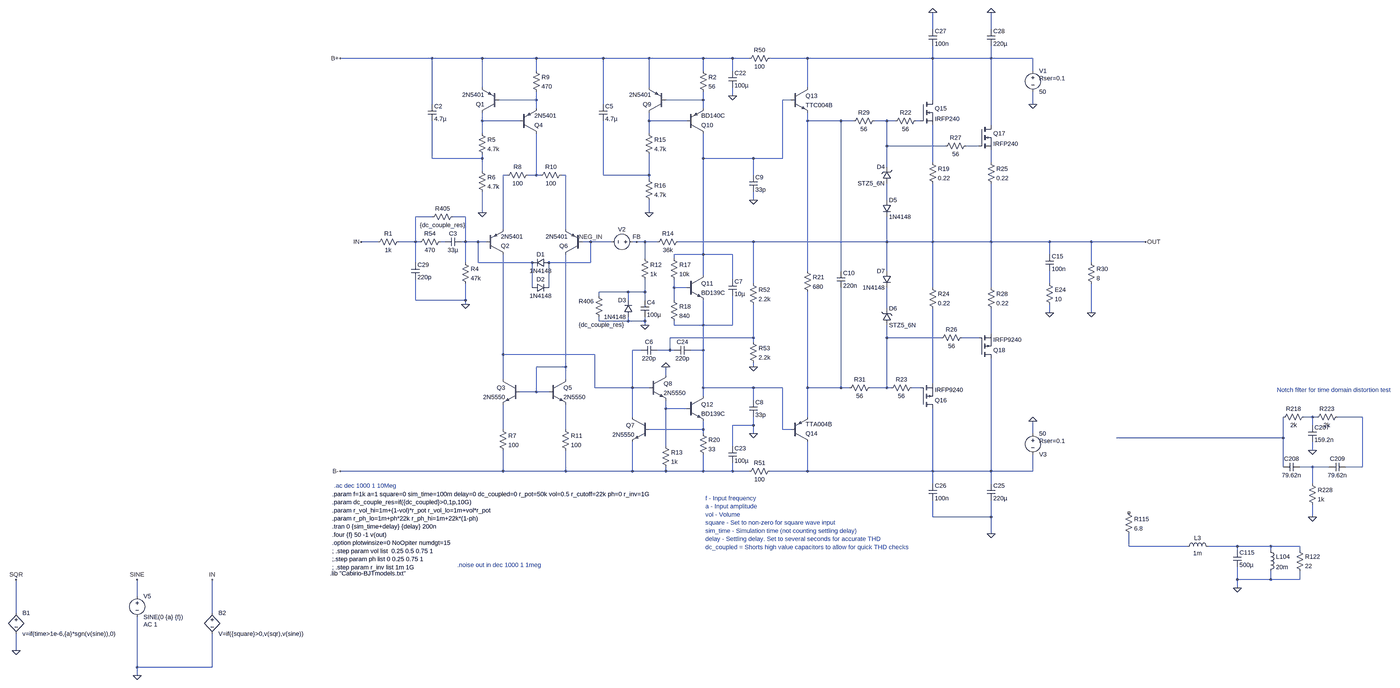
[diagram p0: schematic bog-standard-200w.asc, whole sheet]
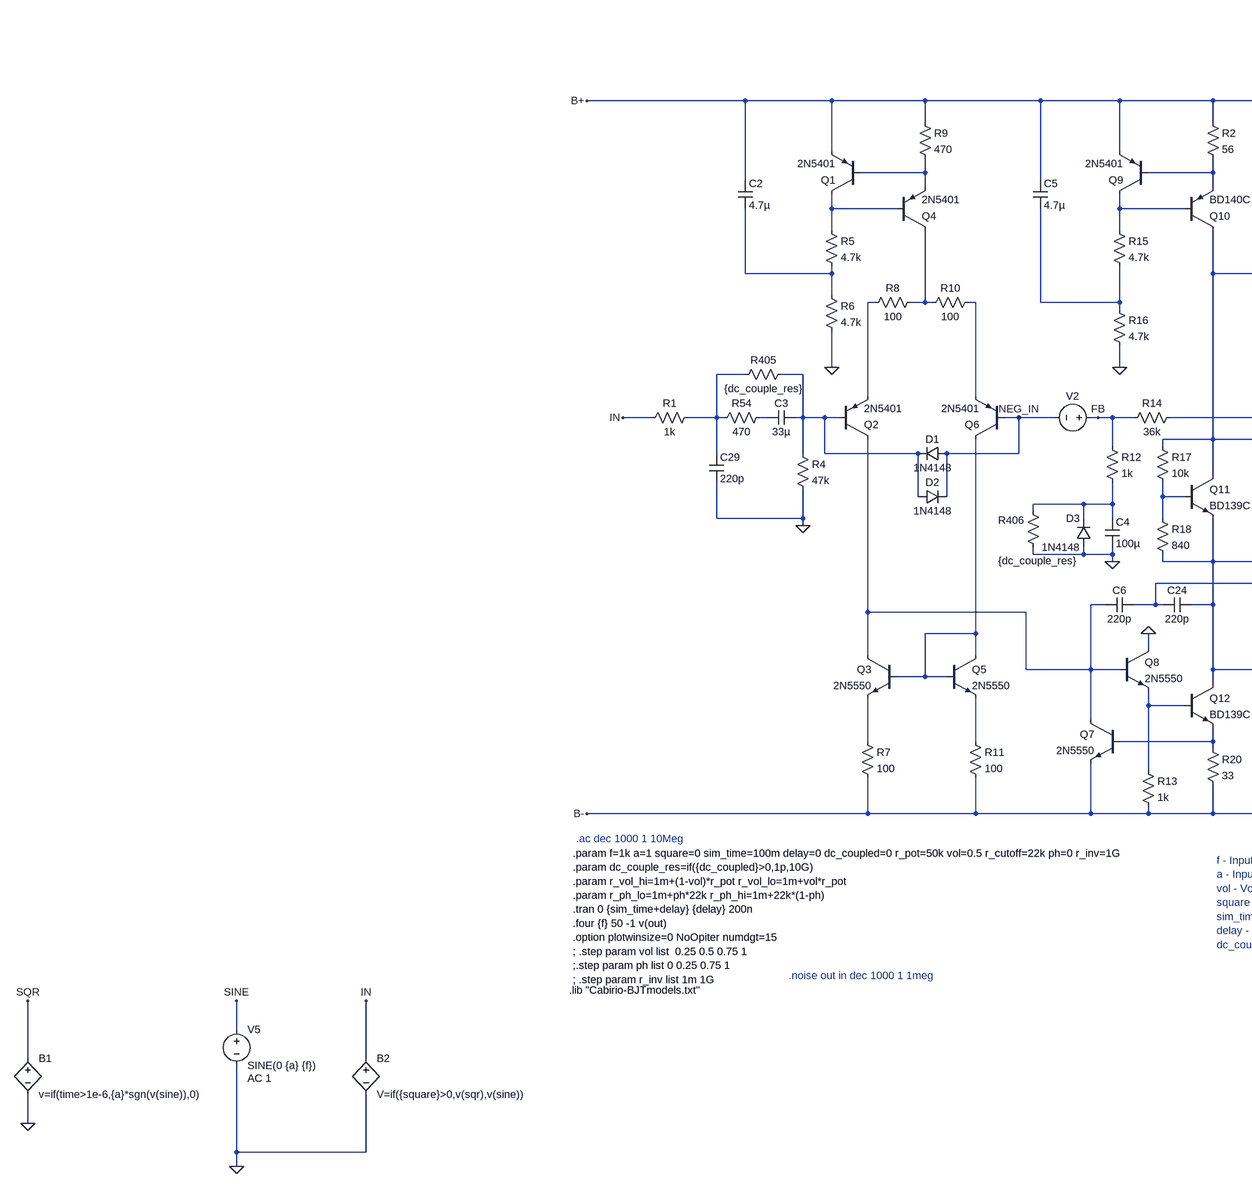
[diagram p1: schematic bog-standard-200w.asc, part, row 1 of 1, column 1 of 2]
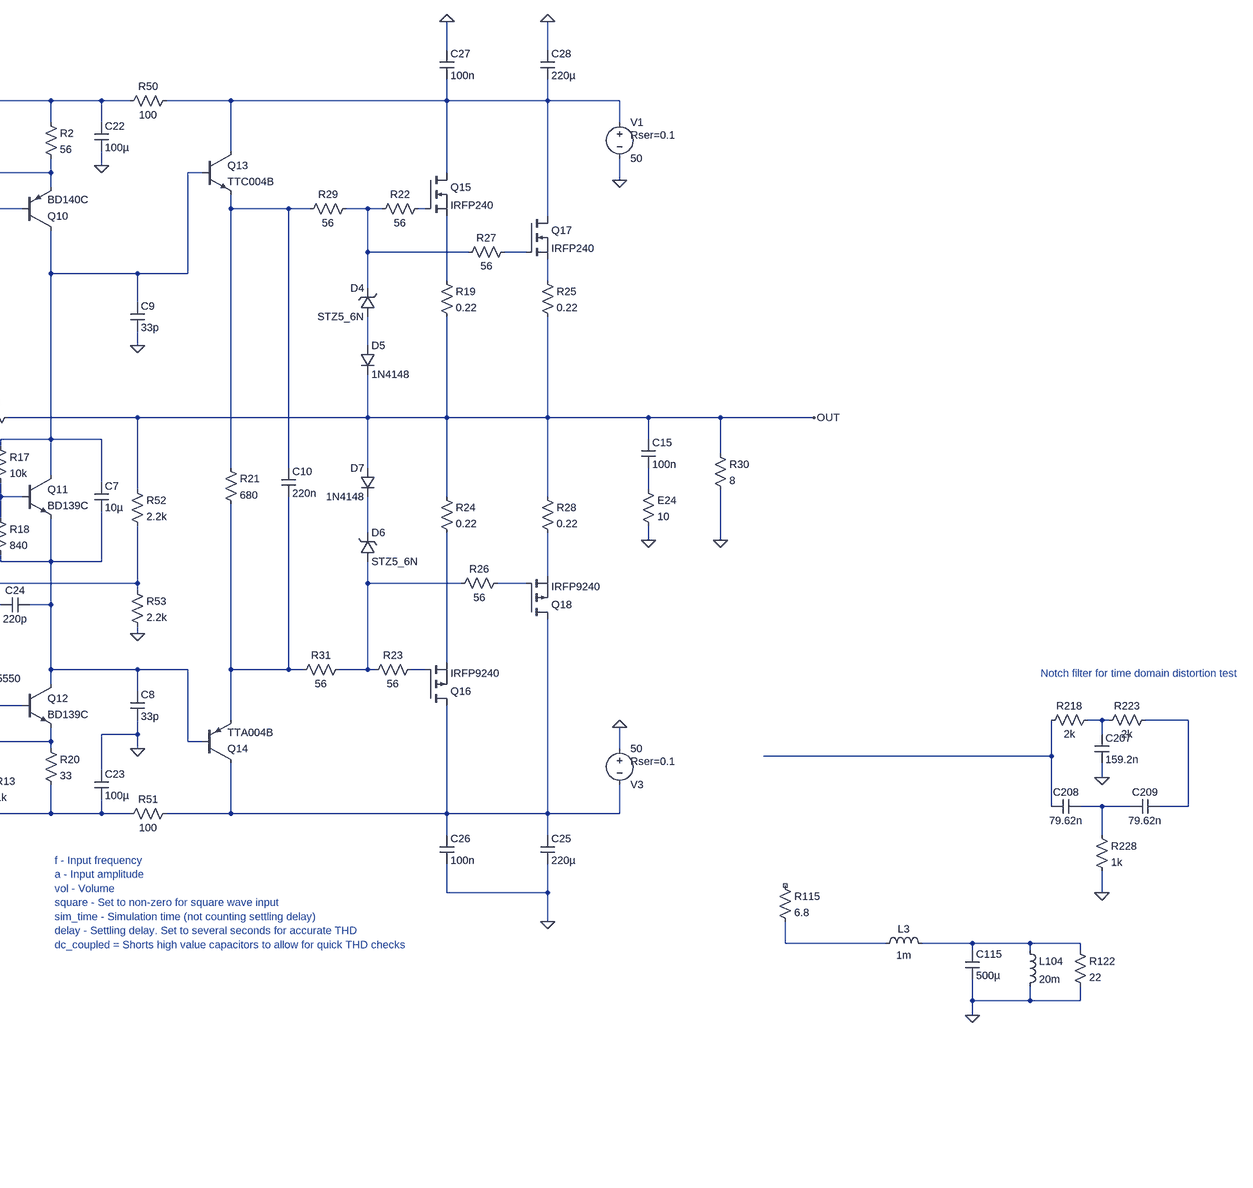
[diagram p2: schematic bog-standard-200w.asc, part, row 1 of 1, column 2 of 2]
bog-standard-200w.asc, the LTspice schematic file:
Version 4
SHEET 1 3812 1508
WIRE 1632 -992 1632 -1056
WIRE 1856 -992 1856 -1056
WIRE -288 -880 -640 -880
WIRE -96 -880 -288 -880
WIRE 112 -880 -96 -880
WIRE 368 -880 112 -880
WIRE 544 -880 368 -880
WIRE 752 -880 544 -880
WIRE 864 -880 752 -880
WIRE 928 -880 864 -880
WIRE 1152 -880 1008 -880
WIRE 1632 -880 1632 -928
WIRE 1632 -880 1152 -880
WIRE 1856 -880 1856 -928
WIRE 1856 -880 1632 -880
WIRE 2016 -880 1856 -880
WIRE 112 -832 112 -880
WIRE 752 -832 752 -880
WIRE 864 -832 864 -880
WIRE 2016 -832 2016 -880
WIRE -96 -768 -96 -880
WIRE 544 -768 544 -880
WIRE 1152 -768 1152 -880
WIRE 864 -736 864 -768
WIRE 112 -720 112 -752
WIRE 112 -720 -32 -720
WIRE 752 -720 752 -752
WIRE 752 -720 608 -720
WIRE 1088 -720 1056 -720
WIRE 1632 -720 1632 -880
WIRE -288 -704 -288 -880
WIRE 368 -704 368 -880
WIRE 2016 -704 2016 -752
WIRE 112 -688 112 -720
WIRE 752 -688 752 -720
WIRE -96 -640 -96 -672
WIRE 48 -640 -96 -640
WIRE 544 -640 544 -672
WIRE 688 -640 544 -640
WIRE 1152 -640 1152 -672
WIRE 1280 -640 1152 -640
WIRE 1328 -640 1280 -640
WIRE 1456 -640 1408 -640
WIRE 1488 -640 1456 -640
WIRE 1584 -640 1568 -640
WIRE 1856 -624 1856 -880
WIRE -96 -592 -96 -640
WIRE 544 -592 544 -640
WIRE 1456 -544 1456 -640
WIRE 1680 -544 1456 -544
WIRE 1808 -544 1760 -544
WIRE -288 -496 -288 -640
WIRE -96 -496 -96 -512
WIRE -96 -496 -288 -496
WIRE 752 -496 752 -592
WIRE 944 -496 752 -496
WIRE 1056 -496 1056 -720
WIRE 1056 -496 944 -496
WIRE 1632 -480 1632 -624
WIRE 1856 -480 1856 -528
WIRE 1456 -464 1456 -544
WIRE -96 -448 -96 -496
WIRE 0 -432 -16 -432
WIRE 112 -432 112 -592
WIRE 112 -432 80 -432
WIRE 128 -432 112 -432
WIRE 224 -432 208 -432
WIRE 368 -432 368 -640
WIRE 544 -432 544 -512
WIRE 544 -432 368 -432
WIRE 944 -432 944 -496
WIRE 544 -416 544 -432
WIRE 944 -336 944 -368
WIRE 1456 -336 1456 -400
WIRE -96 -288 -96 -368
WIRE 544 -288 544 -336
WIRE -288 -272 -352 -272
WIRE -160 -272 -208 -272
WIRE -16 -224 -16 -432
WIRE 224 -224 224 -432
WIRE -496 -176 -560 -176
WIRE -352 -176 -352 -272
WIRE -352 -176 -416 -176
WIRE -336 -176 -352 -176
WIRE -240 -176 -256 -176
WIRE -160 -176 -160 -272
WIRE -160 -176 -176 -176
WIRE -112 -176 -160 -176
WIRE -80 -176 -112 -176
WIRE 320 -176 288 -176
WIRE 400 -176 320 -176
WIRE 496 -176 480 -176
WIRE 528 -176 496 -176
WIRE 576 -176 528 -176
WIRE 944 -176 656 -176
WIRE 1456 -176 1456 -272
WIRE 1456 -176 944 -176
WIRE 1632 -176 1632 -400
WIRE 1632 -176 1456 -176
WIRE 1856 -176 1856 -400
WIRE 1856 -176 1632 -176
WIRE 2080 -176 1856 -176
WIRE 2240 -176 2080 -176
WIRE 2448 -176 2240 -176
WIRE 752 -128 752 -496
WIRE 752 -128 640 -128
WIRE 864 -128 752 -128
WIRE 2080 -128 2080 -176
WIRE 528 -112 528 -176
WIRE 640 -112 640 -128
WIRE -352 -96 -352 -176
WIRE -160 -96 -160 -176
WIRE -112 -96 -112 -176
WIRE 96 -96 -112 -96
WIRE 160 -96 144 -96
WIRE 320 -96 320 -176
WIRE 320 -96 160 -96
WIRE 2240 -96 2240 -176
WIRE 1152 -64 1152 -640
WIRE 1280 -64 1280 -640
WIRE 1456 -64 1456 -176
WIRE 752 -48 752 -128
WIRE 864 -32 864 -128
WIRE 944 -16 944 -176
WIRE 2080 -16 2080 -64
WIRE 96 0 96 -96
WIRE 160 0 160 -96
WIRE 640 0 640 -32
WIRE 688 0 640 0
WIRE 1632 0 1632 -176
WIRE 1856 0 1856 -176
WIRE 464 16 352 16
WIRE 528 16 528 -32
WIRE 528 16 464 16
WIRE 352 32 352 16
WIRE -352 48 -352 -32
WIRE -160 48 -160 -16
WIRE -160 48 -352 48
WIRE 464 48 464 16
WIRE 528 48 528 16
WIRE 640 48 640 0
WIRE -160 64 -160 48
WIRE 1456 80 1456 0
WIRE 2080 96 2080 64
WIRE 2240 96 2240 -16
WIRE 352 128 352 112
WIRE 464 128 464 112
WIRE 464 128 352 128
WIRE 528 128 528 112
WIRE 528 128 464 128
WIRE 528 144 528 128
WIRE 640 144 640 128
WIRE 752 144 752 48
WIRE 752 144 640 144
WIRE 864 144 864 32
WIRE 864 144 752 144
WIRE 1856 176 1856 80
WIRE 944 192 944 64
WIRE 944 192 624 192
WIRE 1456 192 1456 144
WIRE 1664 192 1456 192
WIRE 1808 192 1744 192
WIRE 944 208 944 192
WIRE 512 240 480 240
WIRE 624 240 624 192
WIRE 624 240 576 240
WIRE 640 240 624 240
WIRE 752 240 752 144
WIRE 752 240 704 240
WIRE -16 256 -16 -128
WIRE 336 256 -16 256
WIRE 224 304 224 -128
WIRE 224 304 112 304
WIRE 944 304 944 288
WIRE 608 336 608 304
WIRE -16 352 -16 256
WIRE 224 352 224 304
WIRE 1632 368 1632 80
WIRE 336 384 336 256
WIRE 480 384 480 240
WIRE 480 384 336 384
WIRE 544 384 480 384
WIRE 752 384 752 240
WIRE 944 384 752 384
WIRE 1056 384 944 384
WIRE 1152 384 1152 16
WIRE 1280 384 1280 0
WIRE 1280 384 1152 384
WIRE 1312 384 1280 384
WIRE 1456 384 1456 192
WIRE 1456 384 1392 384
WIRE 1472 384 1456 384
WIRE 1584 384 1552 384
WIRE 112 400 112 304
WIRE 112 400 48 400
WIRE 160 400 112 400
WIRE 752 416 752 384
WIRE 944 432 944 384
WIRE 608 464 608 432
WIRE 688 464 608 464
WIRE 480 496 480 384
WIRE 1152 496 1152 384
WIRE 3088 496 3056 496
WIRE 3104 496 3088 496
WIRE 3280 496 3184 496
WIRE 944 528 944 496
WIRE 944 528 864 528
WIRE 3088 528 3088 496
WIRE -16 544 -16 448
WIRE 224 544 224 448
WIRE 752 544 752 512
WIRE 752 544 544 544
WIRE 1056 544 1056 384
WIRE 1088 544 1056 544
WIRE 752 560 752 544
WIRE 944 560 944 528
WIRE 2016 560 2016 512
WIRE 2976 576 2976 496
WIRE 2976 576 2336 576
WIRE 608 608 608 464
WIRE 864 608 864 528
WIRE 3088 624 3088 592
WIRE 2976 688 2976 576
WIRE 3088 688 3040 688
WIRE 3152 688 3088 688
WIRE 3280 688 3280 496
WIRE 3280 688 3216 688
WIRE -16 704 -16 624
WIRE -16 704 -640 704
WIRE 224 704 224 624
WIRE 224 704 -16 704
WIRE 480 704 480 592
WIRE 480 704 224 704
WIRE 608 704 608 688
WIRE 608 704 480 704
WIRE 752 704 752 640
WIRE 752 704 608 704
WIRE 864 704 864 672
WIRE 864 704 752 704
WIRE 928 704 864 704
WIRE 1152 704 1152 592
WIRE 1152 704 1008 704
WIRE 1632 704 1632 464
WIRE 1632 704 1152 704
WIRE 1856 704 1856 272
WIRE 1856 704 1632 704
WIRE 2016 704 2016 640
WIRE 2016 704 1856 704
WIRE 1632 752 1632 704
WIRE 1856 752 1856 704
WIRE 3088 752 3088 688
WIRE 1632 880 1632 816
WIRE 1856 880 1856 816
WIRE 1856 880 1632 880
WIRE 3088 880 3088 832
WIRE 1856 944 1856 880
WIRE 2384 992 2384 944
WIRE 2608 992 2384 992
WIRE 2800 992 2688 992
WIRE 2928 992 2800 992
WIRE 3040 992 2928 992
WIRE 2800 1008 2800 992
WIRE 2928 1008 2928 992
WIRE 3040 1008 3040 992
WIRE 2800 1120 2800 1072
WIRE 2928 1120 2928 1088
WIRE 2928 1120 2800 1120
WIRE 3040 1120 3040 1088
WIRE 3040 1120 2928 1120
WIRE 2800 1152 2800 1120
WIRE -1456 1184 -1456 1120
WIRE -1920 1248 -1920 1120
WIRE -1168 1248 -1168 1120
WIRE -1920 1392 -1920 1328
WIRE -1456 1456 -1456 1264
WIRE -1168 1456 -1168 1328
WIRE -1168 1456 -1456 1456
WIRE -1456 1488 -1456 1456
FLAG 528 144 0
FLAG -560 -176 IN
FLAG -1168 1120 IN
FLAG -640 704 B-
FLAG -640 -880 B+
FLAG 2448 -176 OUT
FLAG 320 -176 NEG_IN
FLAG 496 -176 FB
FLAG 2080 96 0
FLAG 3088 624 0
FLAG 3088 880 0
FLAG -1456 1488 0
FLAG 944 560 0
FLAG 944 -336 0
FLAG -1920 1392 0
FLAG -1456 1120 SINE
FLAG -1920 1120 SQR
FLAG 608 304 0
FLAG -160 64 0
FLAG 2800 1152 0
FLAG -96 -288 0
FLAG 544 -288 0
FLAG 2240 96 0
FLAG 2016 -704 0
FLAG 2016 512 0
FLAG 864 -736 0
FLAG 944 304 0
FLAG 1856 944 0
FLAG 1632 -1056 0
FLAG 1856 -1056 0
SYMBOL res 672 -192 R90
WINDOW 0 0 56 VBottom 2
WINDOW 3 32 56 VTop 2
SYMATTR InstName R14
SYMATTR Value 36k
SYMBOL res 512 -128 R0
SYMATTR InstName R12
SYMATTR Value 1k
SYMBOL cap 512 48 R0
SYMATTR InstName C4
SYMATTR Value 100µ
SYMBOL res -176 -112 R0
SYMATTR InstName R4
SYMATTR Value 47k
SYMBOL res -400 -192 R90
WINDOW 0 0 56 VBottom 2
WINDOW 3 32 56 VTop 2
SYMATTR InstName R1
SYMATTR Value 1k
SYMBOL cap 576 224 R90
WINDOW 0 0 32 VBottom 2
WINDOW 3 32 32 VTop 2
SYMATTR InstName C6
SYMATTR Value 220p
SYMBOL npn 688 -48 R0
SYMATTR InstName Q11
SYMATTR Value BD139C
SYMBOL res 624 -128 R0
SYMATTR InstName R17
SYMATTR Value 10k
SYMBOL res 624 32 R0
SYMATTR InstName R18
SYMATTR Value 840
SYMBOL cap 2064 -128 R0
SYMATTR InstName C15
SYMATTR Value 100n
SYMBOL res 2064 -32 R0
SYMATTR InstName E24
SYMATTR Value 10
SYMBOL cap 848 -32 R0
SYMATTR InstName C7
SYMATTR Value 10µ
SYMBOL voltage -1456 1168 R0
WINDOW 123 24 124 Left 2
WINDOW 39 0 0 Left 0
SYMATTR Value2 AC 1
SYMATTR InstName V5
SYMATTR Value SINE(0 {a} {f})
SYMBOL res 3072 480 R90
WINDOW 0 0 56 VBottom 2
WINDOW 3 32 56 VTop 2
SYMATTR InstName R218
SYMATTR Value 2k
SYMBOL res 3200 480 R90
WINDOW 0 0 56 VBottom 2
WINDOW 3 32 56 VTop 2
SYMATTR InstName R223
SYMATTR Value 2k
SYMBOL cap 3072 528 R0
SYMATTR InstName C207
SYMATTR Value 159.2n
SYMBOL cap 2976 704 R270
WINDOW 0 32 32 VTop 2
WINDOW 3 0 32 VBottom 2
SYMATTR InstName C208
SYMATTR Value 79.62n
SYMBOL cap 3152 704 R270
WINDOW 0 32 32 VTop 2
WINDOW 3 0 32 VBottom 2
SYMATTR InstName C209
SYMATTR Value 79.62n
SYMBOL res 3072 736 R0
SYMATTR InstName R228
SYMATTR Value 1k
SYMBOL nmos 1584 -720 R0
SYMATTR InstName Q15
SYMATTR Value IRFP240
SYMBOL pmos 1584 464 M180
SYMATTR InstName Q16
SYMATTR Value IRFP9240
SYMBOL res 1584 -656 R90
WINDOW 0 0 56 VBottom 2
WINDOW 3 32 56 VTop 2
SYMATTR InstName R22
SYMATTR Value 56
SYMBOL res 1568 368 R90
WINDOW 0 0 56 VBottom 2
WINDOW 3 32 56 VTop 2
SYMATTR InstName R23
SYMATTR Value 56
SYMBOL diode 1440 -336 R0
SYMATTR InstName D5
SYMATTR Value 1N4148
SYMBOL zener 1472 -400 R180
WINDOW 0 24 64 Left 2
WINDOW 3 24 0 Left 2
SYMATTR InstName D4
SYMATTR Value STZ5_6N
SYMATTR Description Diode
SYMATTR Type diode
SYMBOL zener 1440 144 M180
WINDOW 0 24 64 Left 2
WINDOW 3 24 0 Left 2
SYMATTR InstName D6
SYMATTR Value STZ5_6N
SYMATTR Description Diode
SYMATTR Type diode
SYMBOL diode 1472 -64 M0
SYMATTR InstName D7
SYMATTR Value 1N4148
SYMBOL cap -176 -192 R90
WINDOW 0 0 32 VBottom 2
WINDOW 3 32 32 VTop 2
SYMATTR InstName C3
SYMATTR Value 33µ
SYMBOL npn 1088 -768 R0
SYMATTR InstName Q13
SYMATTR Value TTC004B
SYMBOL pnp 1088 592 M180
SYMATTR InstName Q14
SYMATTR Value TTA004B
SYMBOL res 1136 -80 R0
SYMATTR InstName R21
SYMATTR Value 680
SYMBOL cap 1264 -64 R0
SYMATTR InstName C10
SYMATTR Value 220n
SYMBOL bv -1920 1232 R0
SYMATTR InstName B1
SYMATTR Value v=if(time>1e-6,{a}*sgn(v(sine)),0)
SYMBOL bv -1168 1232 R0
SYMATTR InstName B2
SYMATTR Value V=if({square}>0,v(sqr),v(sine))
SYMBOL npn 688 416 R0
SYMATTR InstName Q12
SYMATTR Value BD139C
SYMBOL npn 544 336 R0
SYMATTR InstName Q8
SYMATTR Value 2N5550
SYMBOL res 736 544 R0
SYMATTR InstName R20
SYMATTR Value 33
SYMBOL diode 480 112 R180
WINDOW 0 24 64 Left 2
WINDOW 3 24 0 Left 2
SYMATTR InstName D3
SYMATTR Value 1N4148
SYMBOL pnp 688 -592 M180
SYMATTR InstName Q10
SYMATTR Value BD140C
SYMBOL pnp 608 -672 R180
SYMATTR InstName Q9
SYMATTR Value 2N5401
SYMBOL res 528 -608 R0
SYMATTR InstName R15
SYMATTR Value 4.7k
SYMBOL npn 160 352 R0
SYMATTR InstName Q5
SYMATTR Value 2N5550
SYMBOL npn 48 352 M0
SYMATTR InstName Q3
SYMATTR Value 2N5550
SYMBOL res -32 528 R0
SYMATTR InstName R7
SYMATTR Value 100
SYMBOL res 208 528 R0
SYMATTR InstName R11
SYMATTR Value 100
SYMBOL pnp 48 -592 M180
SYMATTR InstName Q4
SYMATTR Value 2N5401
SYMBOL res 96 -848 R0
SYMATTR InstName R9
SYMATTR Value 470
SYMBOL pnp -32 -672 R180
SYMATTR InstName Q1
SYMATTR Value 2N5401
SYMBOL res -112 -608 R0
SYMATTR InstName R5
SYMATTR Value 4.7k
SYMBOL res 224 -448 R90
WINDOW 0 0 56 VBottom 2
WINDOW 3 32 56 VTop 2
SYMATTR InstName R10
SYMATTR Value 100
SYMBOL res 96 -448 R90
WINDOW 0 0 56 VBottom 2
WINDOW 3 32 56 VTop 2
SYMATTR InstName R8
SYMATTR Value 100
SYMBOL pnp 288 -128 R180
SYMATTR InstName Q6
SYMATTR Value 2N5401
SYMBOL pnp -80 -128 M180
SYMATTR InstName Q2
SYMATTR Value 2N5401
SYMBOL res -192 -288 R90
WINDOW 0 0 56 VBottom 2
WINDOW 3 32 56 VTop 2
SYMATTR InstName R405
SYMATTR Value {dc_couple_res}
SYMBOL res 368 128 R180
WINDOW 0 36 76 Left 2
WINDOW 3 -80 -14 Left 2
SYMATTR InstName R406
SYMATTR Value {dc_couple_res}
SYMBOL res 2368 848 R0
SYMATTR InstName R115
SYMATTR Value 6.8
SYMBOL ind 2592 1008 R270
WINDOW 0 32 56 VTop 2
WINDOW 3 5 56 VBottom 2
SYMATTR InstName L3
SYMATTR Value 1m
SYMBOL cap 2784 1008 R0
SYMATTR InstName C115
SYMATTR Value 500µ
SYMBOL ind 2912 992 R0
SYMATTR InstName L104
SYMATTR Value 20m
SYMBOL res 3024 992 R0
SYMATTR InstName R122
SYMATTR Value 22
SYMBOL voltage 496 -176 R90
WINDOW 0 -32 56 VBottom 2
WINDOW 3 32 56 VTop 2
WINDOW 123 -4 56 VBottom 2
WINDOW 39 0 0 Left 0
SYMATTR InstName V2
SYMATTR Value ""
SYMBOL npn 544 496 M0
SYMATTR InstName Q7
SYMATTR Value 2N5550
SYMBOL res -112 -464 R0
SYMATTR InstName R6
SYMATTR Value 4.7k
SYMBOL res 528 -432 R0
SYMATTR InstName R16
SYMATTR Value 4.7k
SYMBOL res 2224 -112 R0
SYMATTR InstName R30
SYMATTR Value 8
SYMBOL cap -304 -704 R0
SYMATTR InstName C2
SYMATTR Value 4.7µ
SYMBOL cap 352 -704 R0
SYMATTR InstName C5
SYMATTR Value 4.7µ
SYMBOL diode 160 -112 R90
WINDOW 0 0 32 VBottom 2
WINDOW 3 32 32 VTop 2
SYMATTR InstName D1
SYMATTR Value 1N4148
SYMBOL diode 96 16 R270
WINDOW 0 32 32 VTop 2
WINDOW 3 0 32 VBottom 2
SYMATTR InstName D2
SYMATTR Value 1N4148
SYMBOL res 736 -848 R0
SYMATTR InstName R2
SYMATTR Value 56
SYMBOL res 592 592 R0
SYMATTR InstName R13
SYMATTR Value 1k
SYMBOL res 1616 -496 R0
SYMATTR InstName R19
SYMATTR Value 0.22
SYMBOL res 1616 -16 R0
SYMATTR InstName R24
SYMATTR Value 0.22
SYMBOL nmos 1808 -624 R0
SYMATTR InstName Q17
SYMATTR Value IRFP240
SYMBOL res 1776 -560 R90
WINDOW 0 0 56 VBottom 2
WINDOW 3 32 56 VTop 2
SYMATTR InstName R27
SYMATTR Value 56
SYMBOL res 1840 -496 R0
SYMATTR InstName R25
SYMATTR Value 0.22
SYMBOL pmos 1808 272 M180
SYMATTR InstName Q18
SYMATTR Value IRFP9240
SYMBOL res 1760 176 R90
WINDOW 0 0 56 VBottom 2
WINDOW 3 32 56 VTop 2
SYMATTR InstName R26
SYMATTR Value 56
SYMBOL res 1840 -16 R0
SYMATTR InstName R28
SYMATTR Value 0.22
SYMBOL res 1424 -656 R90
WINDOW 0 0 56 VBottom 2
WINDOW 3 32 56 VTop 2
SYMATTR InstName R29
SYMATTR Value 56
SYMBOL res 1408 368 R90
WINDOW 0 0 56 VBottom 2
WINDOW 3 32 56 VTop 2
SYMATTR InstName R31
SYMATTR Value 56
SYMBOL voltage 2016 -848 R0
WINDOW 123 0 0 Left 0
WINDOW 39 24 44 Left 2
SYMATTR SpiceLine Rser=0.1
SYMATTR InstName V1
SYMATTR Value 50
SYMBOL voltage 2016 544 R0
WINDOW 0 24 96 Left 2
WINDOW 3 24 16 Left 2
WINDOW 123 0 0 Left 0
WINDOW 39 24 44 Left 2
SYMATTR InstName V3
SYMATTR Value 50
SYMATTR SpiceLine Rser=0.1
SYMBOL res 1024 -896 R90
WINDOW 0 0 56 VBottom 2
WINDOW 3 32 56 VTop 2
SYMATTR InstName R50
SYMATTR Value 100
SYMBOL cap 848 -832 R0
SYMATTR InstName C22
SYMATTR Value 100µ
SYMBOL res 1024 688 R90
WINDOW 0 0 56 VBottom 2
WINDOW 3 32 56 VTop 2
SYMATTR InstName R51
SYMATTR Value 100
SYMBOL cap 848 608 R0
SYMATTR InstName C23
SYMATTR Value 100µ
SYMBOL cap 928 432 R0
SYMATTR InstName C8
SYMATTR Value 33p
SYMBOL cap 928 -432 R0
SYMATTR InstName C9
SYMATTR Value 33p
SYMBOL cap 704 224 R90
WINDOW 0 0 32 VBottom 2
WINDOW 3 32 32 VTop 2
SYMATTR InstName C24
SYMATTR Value 220p
SYMBOL res 928 -32 R0
SYMATTR InstName R52
SYMATTR Value 2.2k
SYMBOL res 928 192 R0
SYMATTR InstName R53
SYMATTR Value 2.2k
SYMBOL cap 1840 752 R0
SYMATTR InstName C25
SYMATTR Value 220µ
SYMBOL cap 1616 752 R0
SYMATTR InstName C26
SYMATTR Value 100n
SYMBOL cap 1616 -992 R0
SYMATTR InstName C27
SYMATTR Value 100n
SYMBOL cap 1840 -992 R0
SYMATTR InstName C28
SYMATTR Value 220µ
SYMBOL cap -368 -96 R0
SYMATTR InstName C29
SYMATTR Value 220p
SYMBOL res -240 -192 R90
WINDOW 0 0 56 VBottom 2
WINDOW 3 32 56 VTop 2
SYMATTR InstName R54
SYMATTR Value 470
TEXT -672 792 Left 2 !.param f=1k a=1 square=0 sim_time=100m delay=0 dc_coupled=0 r_pot=50k vol=0.5 r_cutoff=22k ph=0 r_inv=1G\n.param dc_couple_res=if({dc_coupled}>0,1p,10G)\n.param r_vol_hi=1m+(1-vol)*r_pot r_vol_lo=1m+vol*r_pot\n.param r_ph_lo=1m+ph*22k r_ph_hi=1m+22k*(1-ph)\n.tran 0 {sim_time+delay} {delay} 200n\n.four {f} 50 -1 v(out)\n.option plotwinsize=0 NoOpiter numdgt=15\n; .step param vol list  0.25 0.5 0.75 1\n;.step param ph list 0 0.25 0.75 1\n; .step param r_inv list 1m 1G
TEXT -664 760 Left 2 ;.ac dec 1000 1 10Meg
TEXT -192 1064 Left 2 ;.noise out in dec 1000 1 1meg
TEXT 2952 392 Left 2 ;Notch filter for time domain distortion test
TEXT 760 808 Left 2 ;f - Input frequency\na - Input amplitude\nvol - Volume\nsquare - Set to non-zero for square wave input\nsim_time - Simulation time (not counting settling delay)\ndelay - Settling delay. Set to several seconds for accurate THD\ndc_coupled = Shorts high value capacitors to allow for quick THD checks
TEXT -680 1096 Left 2 !.lib "Cabirio-BJTmodels.txt"

The netlist it stands for:
* bog-standard-200w.asc
R14 OUT FB 36k
R12 FB N024 1k
C4 N024 0 100µ
R4 N020 0 47k
R1 N019 IN 1k
C6 N028 N031 220p
Q11 N004 N023 N026 0 BD139C
R17 N004 N023 10k
R18 N023 N026 840
C15 OUT N022 100n
R§E24 N022 0 10
C7 N004 N026 10µ
V5 SINE 0 SINE(0 {a} {f}) AC 1
R218 N037 N042 2k
R223 N038 N037 2k
C207 N037 0 159.2n
C208 N042 N043 79.62n
C209 N043 N038 79.62n
R228 N043 0 1k
M§Q15 N001 N009 N012 N012 IRFP240
M§Q16 N044 N035 N033 N033 IRFP9240
R22 N009 N008 56
R23 N035 N029 56
D5 N018 OUT 1N4148
D4 N018 N008 STZ5_6N
D6 N029 N025 STZ5_6N
D7 OUT N025 1N4148
C3 N020 N021 33µ
Q13 N001 N004 N007 0 TTC004B
Q14 N044 N026 N034 0 TTA004B
R21 N007 N034 680
C10 N007 N034 220n
B1 SQR 0 v=if(time>1e-6,{a}*sgn(v(sine)),0)
B2 IN 0 V=if({square}>0,v(sqr),v(sine))
Q12 N026 N036 N041 0 BD139C
Q8 0 N031 N036 0 2N5550
R20 N041 B- 33
D3 0 N024 1N4148
Q10 N004 N006 N003 0 BD140C
Q9 N006 N003 B+ 0 2N5401
R15 N006 N017 4.7k
Q5 N032 N032 N040 0 2N5550
Q3 N031 N032 N039 0 2N5550
R7 N039 B- 100
R11 N040 B- 100
Q4 N015 N005 N002 0 2N5401
R9 B+ N002 470
Q1 N005 N002 B+ 0 2N5401
R5 N005 N011 4.7k
R10 N016 N015 100
R8 N015 N014 100
Q6 N032 NEG_IN N016 0 2N5401
Q2 N031 N020 N014 0 2N5401
R405 N020 N019 {dc_couple_res}
R406 0 N024 {dc_couple_res}
R115 NC_01 N045 6.8
L3 N045 N046 1m
C115 N046 0 500µ
L104 N046 0 20m
R122 N046 0 22
V2 FB NEG_IN
Q7 N031 N041 B- 0 2N5550
R6 N011 0 4.7k
R16 N017 0 4.7k
R30 OUT 0 8
C2 B+ N011 4.7µ
C5 B+ N017 4.7µ
D1 NEG_IN N020 1N4148
D2 N020 NEG_IN 1N4148
R2 B+ N003 56
R13 N036 B- 1k
R19 N012 OUT 0.22
R24 OUT N033 0.22
M§Q17 N001 N010 N013 N013 IRFP240
R27 N010 N008 56
R25 N013 OUT 0.22
M§Q18 N044 N030 N027 N027 IRFP9240
R26 N030 N029 56
R28 OUT N027 0.22
R29 N008 N007 56
R31 N029 N034 56
V1 N001 0 50 Rser=0.1
V3 0 N044 50 Rser=0.1
R50 N001 B+ 100
C22 B+ 0 100µ
R51 N044 B- 100
C23 0 B- 100µ
C8 N026 0 33p
C9 N004 0 33p
C24 N026 N028 220p
R52 OUT N028 2.2k
R53 N028 0 2.2k
C25 N044 0 220µ
C26 N044 0 100n
C27 0 N001 100n
C28 0 N001 220µ
C29 N019 0 220p
R54 N021 N019 470
.model D D
.lib standard.dio
.model NPN NPN
.model PNP PNP
.lib standard.bjt
.model NMOS NMOS
.model PMOS PMOS
.lib standard.mos
.param f=1k a=1 square=0 sim_time=100m delay=0 dc_coupled=0 r_pot=50k vol=0.5 r_cutoff=22k ph=0 r_inv=1G
.param dc_couple_res=if({dc_coupled}>0,1p,10G)
.param r_vol_hi=1m+(1-vol)*r_pot r_vol_lo=1m+vol*r_pot
.param r_ph_lo=1m+ph*22k r_ph_hi=1m+22k*(1-ph)
.tran 0 {sim_time+delay} {delay} 200n
.four {f} 50 -1 v(out)
.option plotwinsize=0 NoOpiter numdgt=15
; .step param vol list  0.25 0.5 0.75 1
;.step param ph list 0 0.25 0.75 1
; .step param r_inv list 1m 1G
* .ac dec 1000 1 10Meg
* .noise out in dec 1000 1 1meg
* Notch filter for time domain distortion test
* f - Input frequency
* a - Input amplitude
* vol - Volume
* square - Set to non-zero for square wave input
* sim_time - Simulation time (not counting settling delay)
* delay - Settling delay. Set to several seconds for accurate THD
* dc_coupled = Shorts high value capacitors to allow for quick THD checks
.lib "Cabirio-BJTmodels.txt"
.backanno
.end